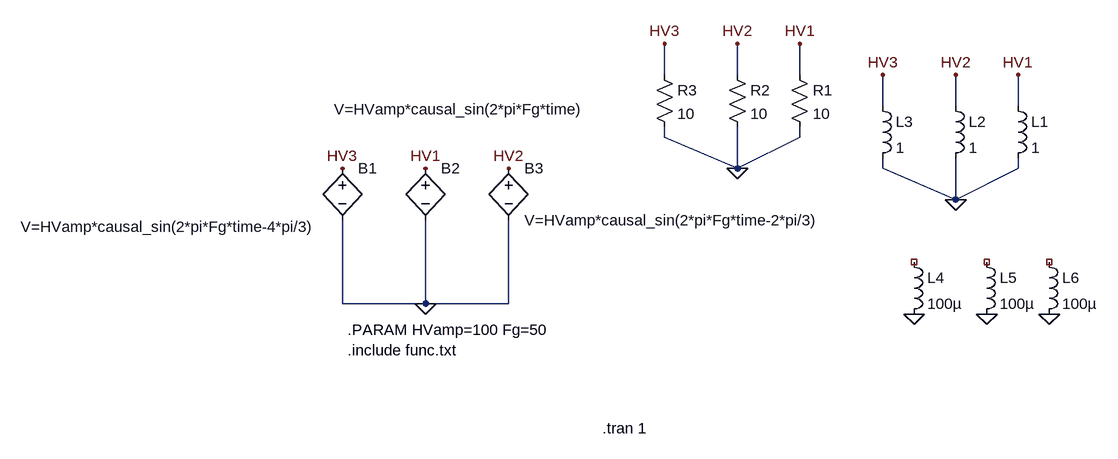
[diagram p0: schematic transfo_tri.asc]
transfo_tri.asc, the LTspice schematic file:
Version 4
SHEET 1 880 680
WIRE -112 -96 -112 -144
WIRE 0 -96 0 -144
WIRE 96 -96 96 -144
WIRE 224 -48 224 -96
WIRE 336 -48 336 -96
WIRE 432 -48 432 -96
WIRE -112 0 -112 -16
WIRE 96 0 96 -16
WIRE 0 48 0 -16
WIRE 0 48 -112 0
WIRE 0 48 96 0
WIRE 224 48 224 32
WIRE 432 48 432 32
WIRE 336 96 336 32
WIRE 336 96 224 48
WIRE 336 96 432 48
WIRE -608 256 -608 128
WIRE -480 256 -480 128
WIRE -480 256 -608 256
WIRE -352 256 -352 128
WIRE -352 256 -480 256
FLAG 272 272 0
FLAG 384 272 0
FLAG 480 272 0
FLAG -480 256 0
FLAG -480 48 HV1
FLAG -352 48 HV2
FLAG -608 48 HV3
FLAG 432 -96 HV1
FLAG 336 -96 HV2
FLAG 224 -96 HV3
FLAG 336 96 0
FLAG 96 -144 HV1
FLAG 0 -144 HV2
FLAG -112 -144 HV3
FLAG 0 48 0
SYMBOL ind 416 -64 R0
SYMATTR InstName L1
SYMATTR Value 1
SYMBOL ind 320 -64 R0
SYMATTR InstName L2
SYMATTR Value 1
SYMBOL ind 208 -64 R0
SYMATTR InstName L3
SYMATTR Value 1
SYMBOL ind 256 176 R0
SYMATTR InstName L4
SYMATTR Value 100µ
SYMBOL ind 368 176 R0
SYMATTR InstName L5
SYMATTR Value 100µ
SYMBOL ind 464 176 R0
SYMATTR InstName L6
SYMATTR Value 100µ
SYMBOL bv -608 32 R0
WINDOW 3 -495 106 Left 2
SYMATTR Value V=HVamp*causal_sin(2*pi*Fg*time-4*pi/3)
SYMATTR InstName B1
SYMBOL bv -480 32 R0
WINDOW 3 -141 -75 Left 2
SYMATTR Value V=HVamp*causal_sin(2*pi*Fg*time)
SYMATTR InstName B2
SYMBOL bv -352 32 R0
SYMATTR InstName B3
SYMATTR Value V=HVamp*causal_sin(2*pi*Fg*time-2*pi/3)
SYMBOL res 80 -112 R0
SYMATTR InstName R1
SYMATTR Value 10
SYMBOL res -16 -112 R0
SYMATTR InstName R2
SYMATTR Value 10
SYMBOL res -128 -112 R0
SYMATTR InstName R3
SYMATTR Value 10
TEXT -208 448 Left 2 !.tran 1
TEXT -600 296 Left 2 !.PARAM HVamp=100 Fg=50
TEXT -600 328 Left 2 !.include func.txt

The netlist it stands for:
* transfo_tri.asc
L1 HV1 0 1
L2 HV2 0 1
L3 HV3 0 1
L4 NC_01 0 100µ
L5 NC_02 0 100µ
L6 NC_03 0 100µ
B1 HV3 0 V=HVamp*causal_sin(2*pi*Fg*time-4*pi/3)
B2 HV1 0 V=HVamp*causal_sin(2*pi*Fg*time)
B3 HV2 0 V=HVamp*causal_sin(2*pi*Fg*time-2*pi/3)
R1 HV1 0 10
R2 HV2 0 10
R3 HV3 0 10
.tran 1
.PARAM HVamp=100 Fg=50
.include func.txt
.backanno
.end